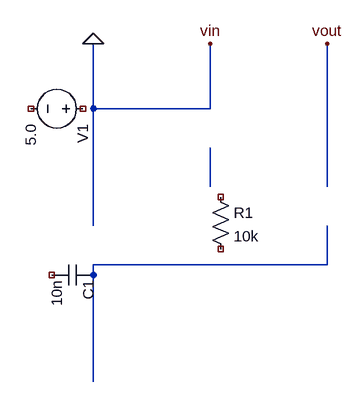
[diagram p0: schematic rc_lowpass.asc]
rc_lowpass.asc, the LTspice schematic file:
Version 4
SHEET 1 880 680
WIRE 180 20 180 80
WIRE 360 20 360 80
WIRE 540 20 540 80
WIRE 360 80 360 120
WIRE 360 120 180 120
WIRE 180 80 180 300
WIRE 360 180 360 240
WIRE 540 80 540 240
WIRE 540 300 540 360
WIRE 540 360 180 360
WIRE 180 360 180 540
FLAG 180 20 0
FLAG 360 20 vin
FLAG 540 20 vout
SYMBOL voltage 180 120 R90
SYMATTR InstName V1
SYMATTR Value 5.0
SYMATTR SpiceLine VV1 vin 0 5.0
SYMBOL res 360 240 R0
SYMATTR InstName R1
SYMATTR Value 10k
SYMATTR SpiceLine RR1 vin vout 10k
SYMBOL cap 180 360 R90
SYMATTR InstName C1
SYMATTR Value 10n
SYMATTR SpiceLine CC1 vout 0 10n

The netlist it stands for:
* rc_lowpass.asc
V1 NC_01 NC_02 5.0 VV1 vin 0 5.0
R1 NC_03 NC_04 10k RR1 vin vout 10k
C1 N002 NC_05 10n CC1 vout 0 10n
.backanno
.end